# Altium project F103_FOC_DebugPCB.PrjPcb
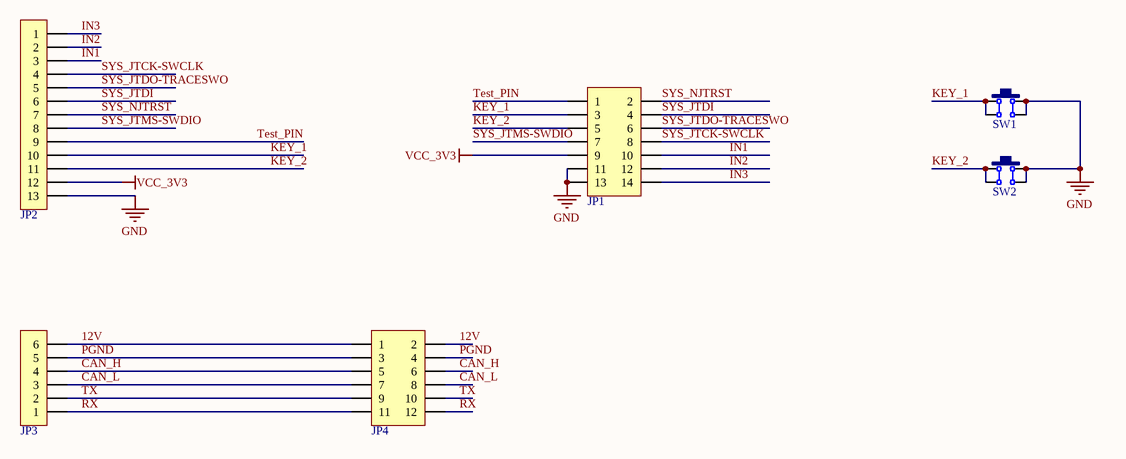
[diagram p0: Debug.SchDoc]
1 sheet, 6 parts. Net scope: global (net labels, ports and power ports of the same name join across sheets).
Board file: Debug.PcbDoc

## Sheet Debug.SchDoc
size A4; SheetNumber: 1; SheetTotal: 1

### Parts
JP1  Header 2X7  [HDR2.54-LI-2x7P]  (value not drawn)
JP2  HDR-1X13  [FPC0.5-WT-13P]  (value not drawn)
JP3  HDR-1X6  [GH-1.25-6P]  (value not drawn)
JP4  Header 6X2  [HDR2.54-LI-2x6P]  (value not drawn)
SW1  6x6x5  [TSW SMD-3*6*4.3]  (value not drawn)
SW2  6x6x5  [TSW SMD-3*6*4.3]  (value not drawn)

### Nets
GND: JP1.11 JP1.13 JP2.13 SW1.2 SW2.2
VCC_3V3: JP1.9 JP2.12
12V: JP3.6 JP4.1 JP4.2
CAN_H: JP3.4 JP4.5 JP4.6
CAN_L: JP3.3 JP4.7 JP4.8
IN1: JP1.10 JP2.3
IN2: JP1.12 JP2.2
IN3: JP1.14 JP2.1
KEY_1: JP1.3 JP2.10 SW1.1
KEY_2: JP1.5 JP2.11 SW2.1
PGND: JP3.5 JP4.3 JP4.4
RX: JP3.1 JP4.11 JP4.12
SYS_JTCK-SWCLK: JP1.8 JP2.4
SYS_JTDI: JP1.4 JP2.6
SYS_JTDO-TRACESWO: JP1.6 JP2.5
SYS_JTMS-SWDIO: JP1.7 JP2.8
SYS_NJTRST: JP1.2 JP2.7
Test_PIN: JP1.1 JP2.9
TX: JP3.2 JP4.9 JP4.10

### Library data of the parts
JP1 = Header 7X2: 7*2P接插件; BOM名称: 7*2P接插件
JP2 = Header 13: 13P连接器; 联系卖家 免费技术支持: 封装库来自淘宝卖家ID：黄晶宝石; BOM名称: 13P连接器
JP3 = Header 6: 6P接插件; BOM名称: 6P接插件
JP4 = Header  6X2: 6*2P接插件; BOM名称: 6*2P接插件
SW1 SW2 = TSW SMD-6x6: 贴片6x6轻触开关; BOM名称: 贴片6x6轻触开关